# Altium schematic sheet ActuatorSensor.SchDoc
size A4
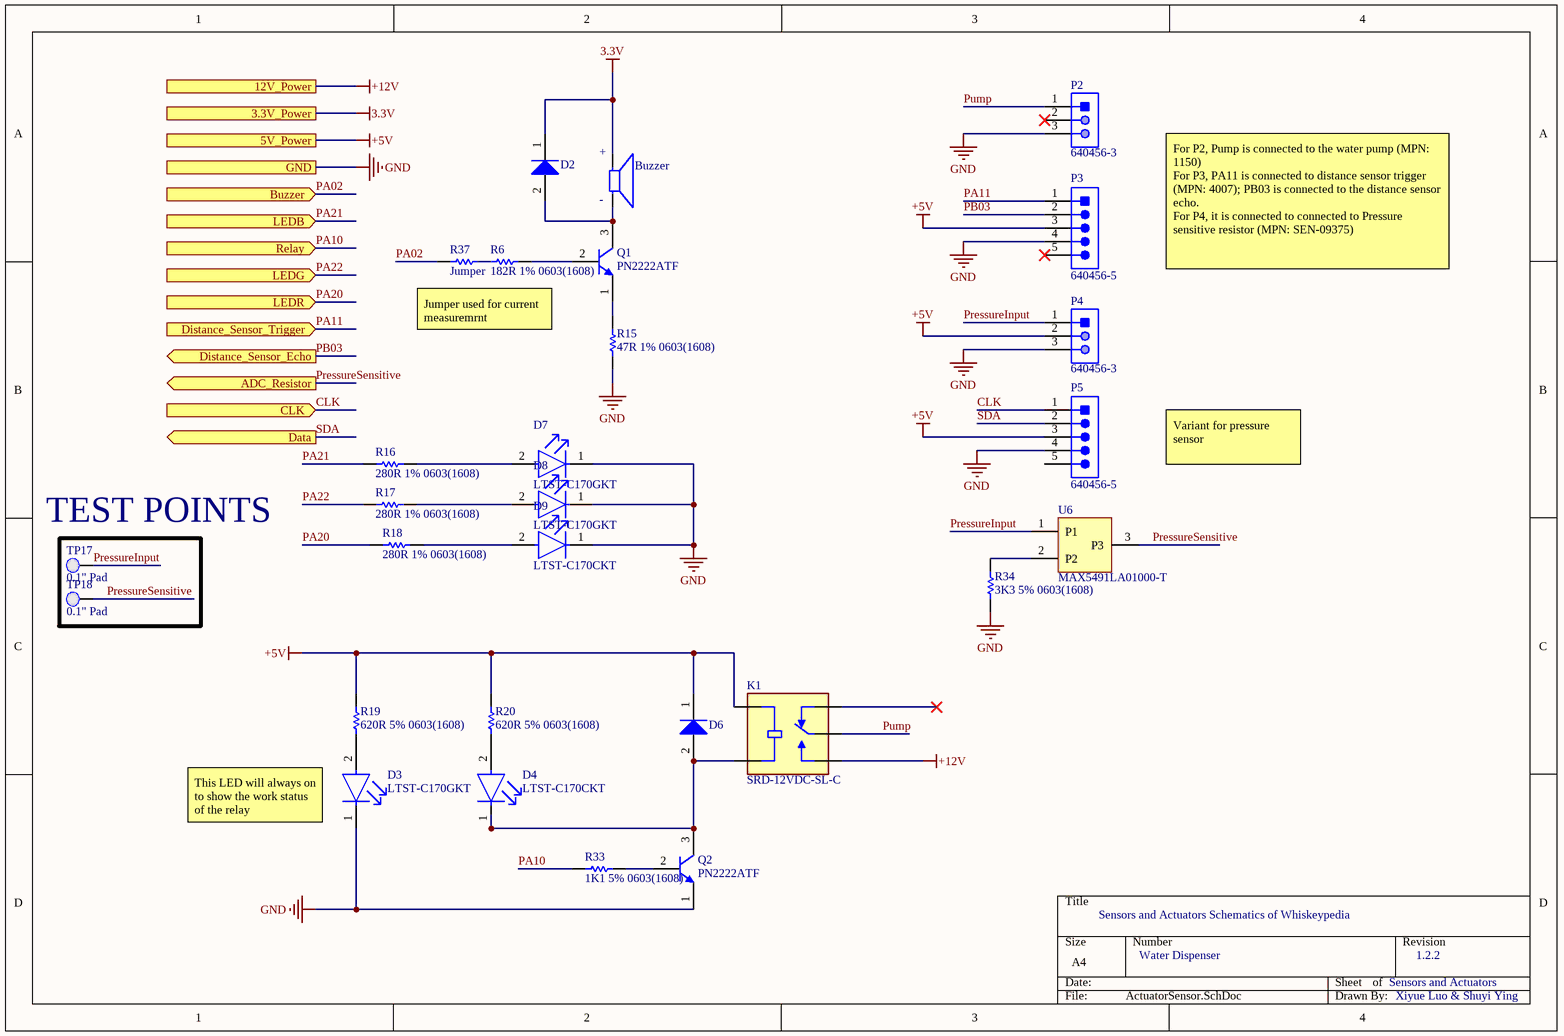
[diagram p0: ActuatorSensor.SchDoc]

## Parts
Buzzer  Buzzer  [Buzzer]  (value not drawn)
D2  BAS16HT1G  [ONSC-SOD-323-2-477-02_V]  (value not drawn)
D3  LTST-C170GKT  [FP-LTST-C170GKT-MFG]
D4  LTST-C170CKT  [FP-LTST-C170CKT-MFG]
D6  BAS16HT1G  [ONSC-SOD-323-2-477-02_V]  (value not drawn)
D7  LTST-C170GKT  [FP-LTST-C170GKT-MFG]
D8  LTST-C170GKT  [FP-LTST-C170GKT-MFG]
D9  LTST-C170CKT  [FP-LTST-C170CKT-MFG]
K1  SRD-12VDC-SL-C  [RELAY_SRD-12VDC-SL-C]
P2  640456-3  [TECO-640456-3]
P3  640456-5  [TECO-640456-5]
P4  640456-3  [TECO-640456-3]
P5  640456-5  [TECO-640456-5]
Q1  PN2222ATF  [FAIR-TO-92-3]
Q2  PN2222ATF  [FAIR-TO-92-3]
R6  182R 1% 0603(1608)  [RESC0603(1608)_N]
R15  47R 1% 0603(1608)  [RESC0603(1608)_M]
R16  280R 1% 0603(1608)  [RESC0603(1608)_M]
R17  280R 1% 0603(1608)  [RESC0603(1608)_M]
R18  280R 1% 0603(1608)  [RESC0603(1608)_M]
R19  620R 5% 0603(1608)  [RESC0603(1608)_M]
R20  620R 5% 0603(1608)  [RESC0603(1608)_M]
R33  1K1 5% 0603(1608)  [RESC0603(1608)_L]
R34  3K3 5% 0603(1608)  [RESC0603(1608)_N]
R37  Jumper  [RESC0805(2012)_N]
TP17  0.1" Pad  [PCBComponent]  (no BOM)
TP18  0.1" Pad  [PCBComponent]  (no BOM)
U6  MAX5491LA01000-T  [MAXM-U3-2_L]

## Ports
3.3V_Power, 5V_Power, 12V_Power, ADC_Resistor (out), Buzzer (in), CLK (in), Data (out), Distance_Sensor_Echo (out), Distance_Sensor_Trigger (in), GND, LEDB (in), LEDG (in), LEDR (in), Relay (in)

## Nets
3.3V: Buzzer.1 D2.1(K) ; port 3.3V_Power
+5V: D6.1(K) K1.COIL1 P3.3(TXO) P4.2 P5.3(TXO) R19.2 R20.2 ; port 5V_Power
+12V: K1.NO ; port 12V_Power
GND: D3.1(C) D7.1(C) D8.1(C) D9.1(C) P2.3 P3.4(VCC) P4.3 P5.4(VCC) Q2.1(E) R15.1 R34.1 ; port GND
CLK: P5.1(DTR) ; port CLK
PA02: R37.1 ; port Buzzer
PA10: R33.1 ; port Relay
PA11: P3.1(DTR) ; port Distance_Sensor_Trigger
PA20: R18.1 ; port LEDR
PA21: R16.1 ; port LEDB
PA22: R17.1 ; port LEDG
PB03: P3.2(RXI) ; port Distance_Sensor_Echo
PressureInput: P4.1 TP17.1(PAD) U6.1(P1)
PressureSensitive: TP18.1(PAD) U6.3(P3) ; port ADC_Resistor
Pump: K1.COM P2.1
SDA: P5.2(RXI) ; port Data
NetBuzzer_2: Buzzer.2 D2.2(A) Q1.3(C)
NetD3_2: D3.2(A) R19.1
NetD4_1: D4.1(C) D6.2(A) K1.COIL2 Q2.3(C)
NetD4_2: D4.2(A) R20.1
NetD7_2: D7.2(A) R16.2
NetD8_2: D8.2(A) R17.2
NetD9_2: D9.2(A) R18.2
NetQ1_1: Q1.1(E) R15.2
NetQ1_2: Q1.2(B) R6.2
NetQ2_2: Q2.2(B) R33.2
NetR6_1: R6.1 R37.2
NetR34_2: R34.2 U6.2(P2)

Not connected (* = marked no-connect by the designer): K1 NC*; P2 2*; P3 5(CTS)*; P5 5(CTS)

## Notes on the sheet
- For P2, Pump is connected to the water pump (MPN: 1150)
  For P3, PA11 is connected to distance sensor trigger (MPN: 4007); PB03 is connected to the distance sensor echo.
  For P4, it is connected to connected to Pressure sensitive resistor (MPN: SEN-09375)
- Jumper used for current measuremrnt
- Variant for pressure sensor
- (near TP17) TEST POINTS
- This LED will always on to show the work status of the relay
- Sensors and Actuators Schematics of Whiskeypedia
- Water Dispenser
- Sensors and Actuators
- 1.2.2
- Xiyue Luo & Shuyi Ying
- (in symbol Buzzer) +; -

## Library data of the parts
Buzzer = Buzzer: 8.5 mm, 5 Vo-p, 100 dB, Surface Mount (SMT), Magnetic Audio Transducer Buzzer; Manufacturer: CUI Devices; Manufacturer Part Number: CMT-8504-100-SMT-TR; Supplier 1: Digi-Key; Supplier Part Number 1: 102-CMT-8504-100-SMT-CT-ND; RoHS: No; Category: Buzzers; Stock 1: 90590; Pricing 1: 1=1.57000, 10=1.30300, 25=1.20440, 50=1.13300, 100=1.06420, 500=0.91430 (USD)
D2 D6 = CMP-1054-00068-1: Switching Diode, 2-Pin SOD-323, Pb-Free, Tape and Reel; Manufacturer: On Semiconductor; Configuration: Single; IF Max (A): 0.2; trr Max (ns): 6; Packing: Tape and Reel; ComponentLink2URL: http://www.onsemi.com/pub_link/Collateral/BAS16HT1-D.PDF; ComponentLink3Description: Package Specification; RoHS: TRUE; PackageDescription: 2-Pin SOD, Body 1.7 x 1.25 mm; PackageReference: SOD-323-2-477-02; PartNumber: BAS16HT1G; ComponentLink1URL: http://www.onsemi.com/; Mounting Technology: Surface Mount; ComponentLink1Description: Manufacturer URL; ComponentLink2Description: Datasheet; DatasheetVersion: Rev. 11; PackageVersion: Rev. H, 03/2007; ComponentLink3URL: http://www.onsemi.com/pub_link/Collateral/477-02.PDF.1
D3 D7 D8 = CMP-1674-00002-6: LED GREEN CLEAR SMD; Dominant Wavelength: 569nm; Lens Style: Diffused; Forward Voltage: 2.1V; Number of Elements: 1; Wavelength: 565nm; Luminous Intensity: 6mcd; Test Current: 10mA; Power Dissipation: 100mW; Reverse Voltage: 5V; Forward Current: 30mA; Viewing Angle: 130°; Lens Color: Colorless; Min Operating Temperature: -55°C; Number of Pins: 2; Max Operating Temperature: 85°C; Color: Green; Radiation Hardening: No; Illumination Color: Green; Case Code (Metric): 2012; Lens Transparency: Clear; Case/Package: 0805; Width: 1.25mm; Case Code (Imperial): 0805; Package Quantity: 1; Height: 1.1mm; Depth: 1.25mm; Length: 2mm; Power Rating: 100mW; Lead Free: Lead Free; Number of LEDs: 1; Packaging: Tape and Reel; Mount: Surface Mount; Voltage: 5V
D4 D9 = CMP-1674-00001-6: LED RED CLEAR SMD; Number of Elements: 1; Power Dissipation: 100mW; Lens Color: Colorless; Voltage: 5V; Wavelength: 660nm; Viewing Angle: 130°; Forward Current: 40mA; Luminous Intensity: 10mcd; Forward Voltage: 1.8V; Test Current: 10mA; Dominant Wavelength: 638nm; Lens Style: Diffused; Max Operating Temperature: 85°C; Packaging: Tape and Reel; Case/Package: 0805; Radiation Hardening: No; Illumination Color: Red; Max Power Dissipation: 100mW; Min Operating Temperature: -55°C; Length: 2mm; Reverse Voltage: 5V; Lead Free: Lead Free; Color: Red; Case Code (Imperial): 0805; Package Quantity: 1; Mount: Surface Mount; Case Code (Metric): 2012; Height: 1.1mm; Power Rating: 100mW; Lens Transparency: Clear; Number of LEDs: 1; Number of Pins: 2; Depth: 1.25mm; Width: 1.25mm
K1 = SRD-12VDC-SL-C: General Purpose Non Latching 12VDC SPDT Through Hole Relays RoHS; MF: Songle Relay; MP: SRD-12VDC-SL-C; Package: Package; Availability: No availability data; Price: None; SnapEDA_Link: https://www.snapeda.com/parts/SRD-12VDC-SL-C/Songle%20Relay/view-part/5710428/?ref=snap; Value: *; Check_prices: https://www.snapeda.com/parts/SRD-12VDC-SL-C/Songle%20Relay/view-part/5710428/?ref=eda
P2 P4 = CMP-2000-05418-1: Male Header, Pitch 2.54 mm, 1 x 3 Position, Height 10.03 mm, Tail Length 3.56 mm, -55 to 105 degC; Manufacturer: TE Connectivity; Agency Approvals: CSA,UL; Angle: Straight; Number of Positions: 3; Standards: RoHSCompliant,ELVCompliant,UL94V-0; Current, Rating: 5 / A; Connector Type: MTA-100; Mount Angle: Vertical; Material, Housing: Polyester; Temperature, Operating: -55to+105 / degC; Voltage, Rating: 250 / V; Color, Housing: White; Contact Centerline Spacing: 0.100 / in.; Special Features: Pinstrip; Material, Contact: CopperAlloy; Contact Termination Area Plating: Tin; Primary Type: InterconnectSystem; Pin Spacing: 0.1 / "; Brand/Series: MTA-100Series; Mounting Hole Size: 0.04 / "; Manufacturer URL: http://www.te.com/; Datasheet URL: https://datasheet.ciiva.com/16456/eng-ds-82056-mta-0608-16456886.pdf; Flammability Rating: UL94V-0; Mounting Type: PCMount; Contact Mating Area Plating: Tin; Datasheet Version: Jun-08; Number of Rows: 1; Termination: Solder; Type: PCBPlug; Length, Pin: 0.14 / "; Color: White; Contact Plating: Tin; Contact Shape: Square; Number of Contacts: 3; Size, Post: 0.025 / in.; Length, Terminal Post: 0.14 / in.; Length, Overall: 0.3 / "
P3 P5 = CMP-1684-00014-1: Male Header, Pitch 2.54 mm, 1 x 5 Position, Height 10.03 mm, Tail Length 3.56 mm, / -55 to 105 degC, RoHS, Bulk; Manufacturer: TE Connectivity; Material, Housing: Polyester; Brand/Series: MTA-100Series; Color, Housing: White; Current, Rating: 5 / A; Temperature, Operating: -55to+105 / °C; Connector Type: MTA-100; Agency Approvals: CSA,UL; Material, Contact: CopperAlloy; Mounting Hole Size: 0.04 / "; Voltage, Rating: 250 / V; Contact Termination Area Plating: Tin; Pin Spacing: 0.1 / "; Primary Type: InterconnectSystem; Special Features: Pinstrip; Mount Angle: Vertical; Contact Centerline Spacing: 0.100 / in.; Number of Contacts: 5; Standards: RoHSCompliant,ELVCompliant,UL94V-0; Angle: Straight; Length, Terminal Post: 0.14 / in.; Manufacturer URL: http://www.te.com; Flammability Rating: UL94V-0; Mounting Type: PCMount; Termination: Solder; Package Reference: THD; Length, Overall: 0.5 / "; Contact Mating Area Plating: Tin; Length, Pin: 0.14 / "; Datasheet URL: http://sigma.octopart.com/77881742/technical_drawing/TE-Connectivity-640456-5.pdf; Package Description: Male Header, Pitch 2.54 mm, 1 x 5 Position, Height 10.03 mm, Tail Length 3.56 mm; Datasheet Version: Rev. W3; Contact Plating: Tin; Color: White; Number of Positions: 5; Type: PCBPlug; Contact Shape: Square; Number of Rows: 1; Size, Post: 0.025 / in.
Q1 Q2 = CMP-2000-06911-1: NPN General-Purpose Amplifier, 40 V, -55 to 150 degC, 3-Pin TO-92, RoHS, Tape and Reel; Manufacturer: FairchildSemiconductor; Configuration: Single; Collector-Emitter Saturation Voltage: 1V; Collector- Emitter Voltage VCEO Max: 40V; Unit Weight: 0.008466oz; Maximum DC Collector Current: 1A; DC Collector/Base Gain hfe Min: 100; Emitter- Base Voltage VEBO: 6V; Maximum Power Dissipation: 625mW; DC Current Gain hFE Max: 300; Gain Bandwidth Product fT: 300MHz; Collector- Base Voltage VCBO: 75V; Mounting Style: ThroughHole; Package Description: 3-Pin Transistor Outline Package, Body Dia 4.79 mm, Pitch 2.6 mm; Mounting Technology: ThroughHole; RoHS: Details; Brand: FairchildSemiconductor; Minimum Operating Temperature: -55C; Package / Case: TO-92-3KinkedLead; Package Reference: TO-92; Series: PN2222; Packaging: Reel; Datasheet Version: Rev. 1.1.0, 07/2014; Datasheet URL: https://www.fairchildsemi.com/datasheets/PN/PN2222A.pdf; Maximum Operating Temperature: +150C; Transistor Polarity: NPN; Factory Pack Quantity: 2000; Manufacturer URL: https://www.fairchildsemi.com/; <PCN>: http://www.mouser.com/PCN/3.26.10LTBDFairchild.pdf; Product Category: BipolarTransistors-BJT
R6 = CMP-1012-00425-1: 182R 0.1W 1% 0603 (1608 Metric)  SMD; Case-EIA: 0603; Value: 182.00 Ohm; Case-Metric: 1608; Technology: SMT; Tolerance: 1 %; Power: 0.1 W
R15 = CMP-1012-00360-1: 47R 0.1W 1% 0603 (1608 Metric)  SMD; Case-EIA: 0603; Case-Metric: 1608; Value: 47.00 Ohm; Power: 0.1 W; Technology: SMT; Tolerance: 1 %
R16-R18 = CMP-1012-00446-1: 280R 0.1W 1% 0603 (1608 Metric)  SMD; Value: 280.00 Ohm; Case-Metric: 1608; Case-EIA: 0603; Power: 0.1 W; Tolerance: 1 %; Technology: SMT
R19 R20 = CMP-1012-00069-1: 620R 0.1W 5% 0603 (1608 Metric)  SMD; Case-Metric: 1608; Value: 620.00 Ohm; Case-EIA: 0603; Tolerance: 5 %; Technology: SMT; Power: 0.1 W
R33 = CMP-1012-00075-1: 1K1 0.1W 5% 0603 (1608 Metric)  SMD; Case-Metric: 1608; Value: 1100.00 Ohm; Case-EIA: 0603; Power: 0.1 W; Technology: SMT; Tolerance: 5 %
R34 = CMP-1012-00086-1: 3K3 0.1W 5% 0603 (1608 Metric)  SMD; Case-EIA: 0603; Value: 3300.00 Ohm; Case-Metric: 1608; Technology: SMT; Tolerance: 5 %; Power: 0.1 W
R37 = CMP-1013-00001-1: Jumper 0805 (2012 Metric); Case-EIA: 0805; Value: 0.00 Ohm; Tolerance: None; Case-Metric: 2012; Technology: SMT; Power: None
TP17 TP18 = 0.1" Pad-A.4
U6 = CMP-0023-00618-2: 30k 2 kV ESD Precision-Matched Resistor-Divider, -40 to 85 degC, 3-pin SOT (U3-2), Tape and Reel; Code_JEDEC: TO236; Applications: Precision Voltage Divider; Mounting Technology: Surface Mount; PackageReference: U3-2; PackageDescription: 3-Pin Small-Outline Transistor Package (U3-2), Body 2.92 x 1.3 mm, Pitch 0.95 mm; ComponentLink3URL: http://pdfserv.maximintegrated.com/package_dwgs/21-0051.PDF; ComponentLink1Description: Manufacturer URL; DatasheetVersion: Rev. 3; PackageVersion: Rev. J, 06/2012; PartNumber: MAX5491LA01000-T; ComponentLink3Description: Package Specification; ComponentLink1URL: http://www.maximintegrated.com/; ComponentLink2Description: Datasheet; ComponentLink2URL: http://datasheets.maximintegrated.com/en/ds/MAX5491.pdf